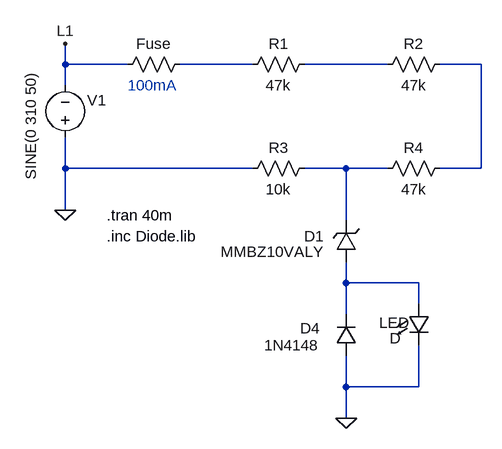
[diagram p0: schematic v1.2.asc]
v1.2.asc, the LTspice schematic file:
Version 4.1
SHEET 1 1084 680
WIRE -144 16 -144 -16
WIRE -48 16 -144 16
WIRE 144 16 32 16
WIRE 352 16 224 16
WIRE 496 16 432 16
WIRE -144 48 -144 16
WIRE -144 176 -144 128
WIRE 144 176 -144 176
WIRE 288 176 224 176
WIRE 352 176 288 176
WIRE 496 176 496 16
WIRE 496 176 432 176
WIRE -144 240 -144 176
WIRE 288 256 288 176
WIRE 288 352 288 320
WIRE 400 352 288 352
WIRE 400 384 400 352
WIRE 288 400 288 352
WIRE 288 512 288 464
WIRE 400 512 400 448
WIRE 400 512 288 512
WIRE 288 560 288 512
FLAG -144 240 0
FLAG -144 -16 L1
FLAG 288 560 0
SYMBOL voltage -144 144 R180
WINDOW 123 0 0 Left 0
WINDOW 39 0 0 Left 0
WINDOW 0 -63 73 Left 2
WINDOW 3 53 -50 VRight 2
SYMATTR InstName V1
SYMATTR Value SINE(0 310 50)
SYMBOL res 240 0 R90
WINDOW 0 0 56 VBottom 2
WINDOW 3 32 56 VTop 2
SYMATTR InstName R1
SYMATTR Value 47k
SYMBOL res 448 0 R90
WINDOW 0 0 56 VBottom 2
WINDOW 3 32 56 VTop 2
SYMATTR InstName R2
SYMATTR Value 47k
SYMBOL res 240 160 R90
WINDOW 0 0 56 VBottom 2
WINDOW 3 32 56 VTop 2
SYMATTR InstName R3
SYMATTR Value 10k
SYMBOL res 448 160 R90
WINDOW 0 0 56 VBottom 2
WINDOW 3 32 56 VTop 2
SYMATTR InstName R4
SYMATTR Value 47k
SYMBOL zener 304 320 R180
WINDOW 0 50 40 Left 2
WINDOW 3 50 16 Left 2
SYMATTR InstName D1
SYMATTR Value MMBZ10VALY
SYMBOL diode 304 464 R180
WINDOW 0 56 42 Left 2
WINDOW 3 57 16 Left 2
SYMATTR InstName D4
SYMATTR Value 1N4148
SYMBOL LED 384 384 R0
WINDOW 0 -45 29 Left 2
WINDOW 3 -29 53 Left 2
SYMATTR InstName LED
SYMBOL res 48 0 R90
WINDOW 0 0 56 VBottom 2
WINDOW 3 32 56 Invisible 2
SYMATTR InstName Fuse
SYMATTR Value 0
TEXT -80 248 Left 2 !.tran 40m
TEXT -80 280 Left 2 !.inc Diode.lib
TEXT -48 48 Left 2 ;100mA

The netlist it stands for:
* v1.2.asc
V1 0 L1 SINE(0 310 50)
R1 N002 N001 47k
R2 N003 N002 47k
R3 N004 0 10k
R4 N003 N004 47k
D1 N005 N004 MMBZ10VALY
D4 0 N005 1N4148
D§LED N005 0 D
R§Fuse N001 L1 0
.model D D
.lib standard.dio
.tran 40m
.inc Diode.lib
* 100mA
.backanno
.end